# EAGLE design ESP8266_1wire_Gateway_NodeMCU_WeMosD1Mini_max (EAGLE 7.5.0)
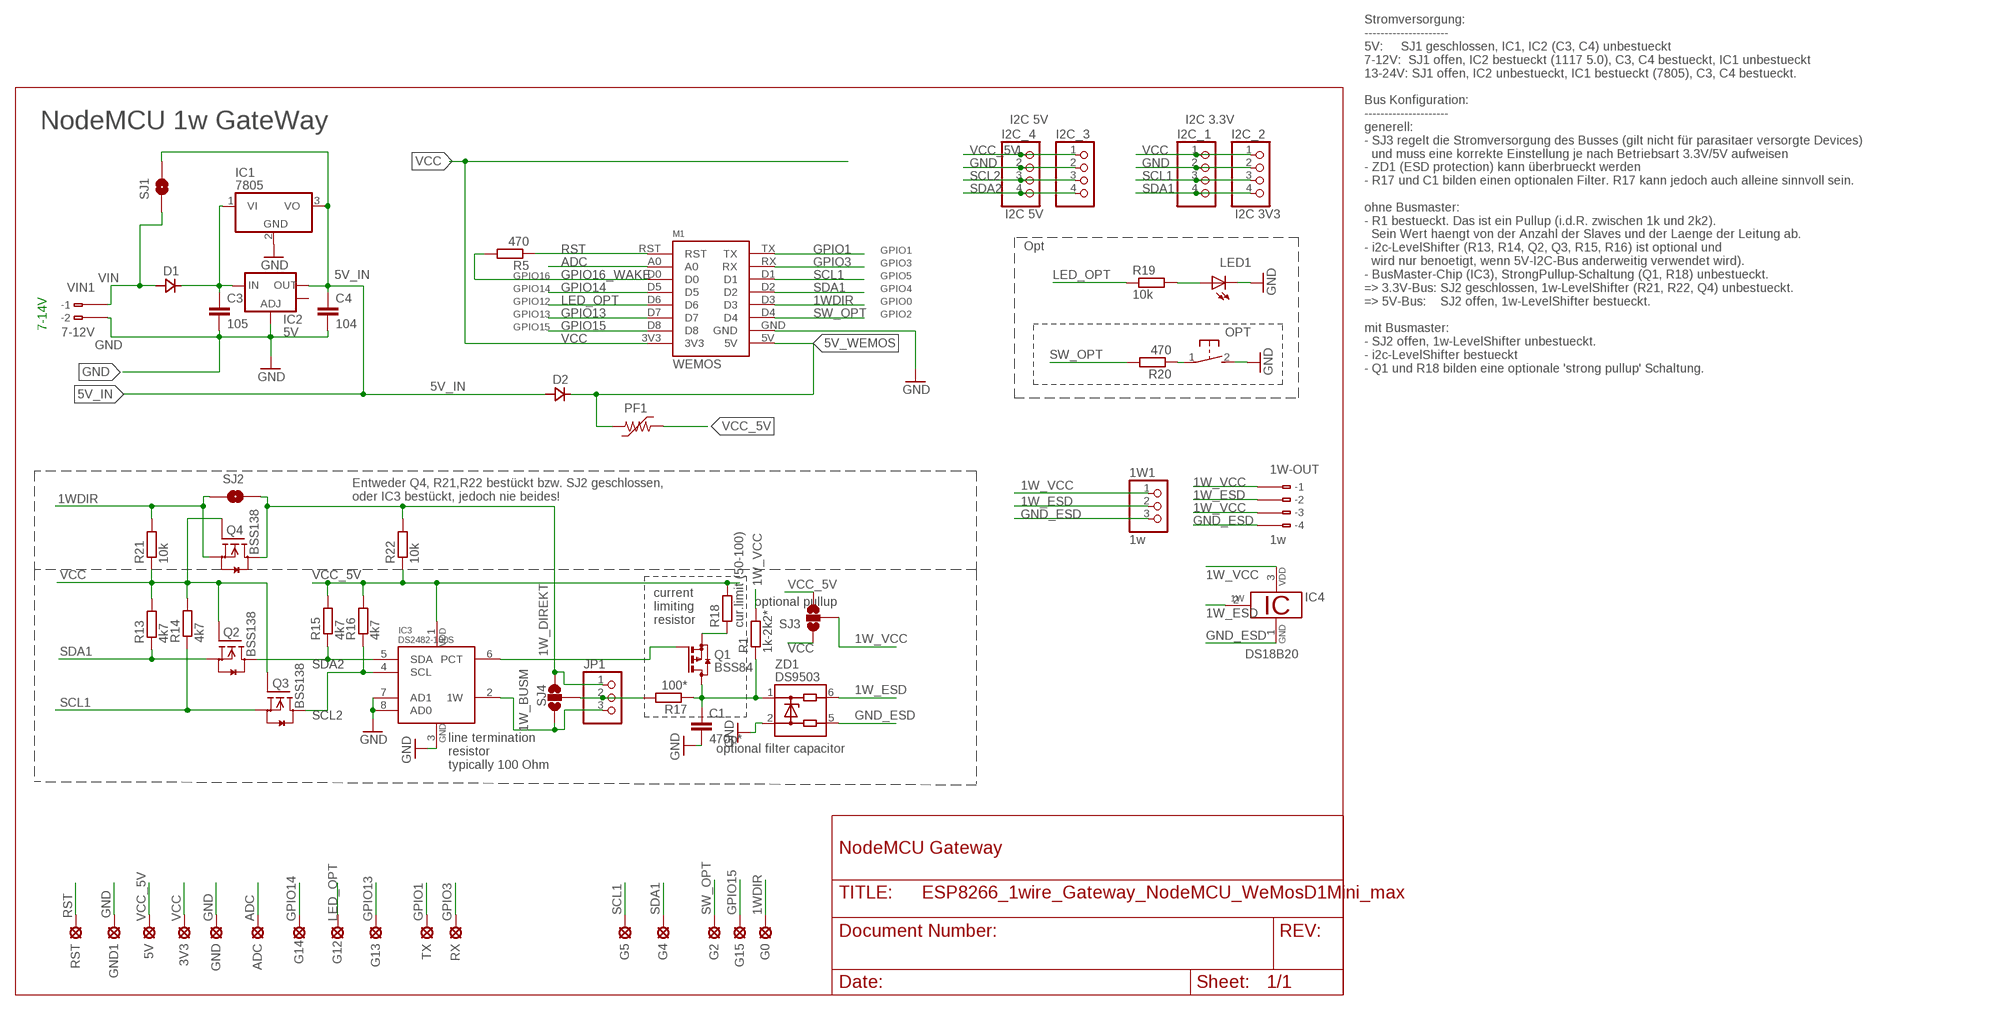
[diagram p0: schematic, sheet 1]

## Parts
1W1  1w  PINHD-1X3_S  [1X03]
1W-OUT  1w  CON_350-104  [CON_350-104]
3V3  LSP10  [LSP10]
5V  LSP10  [LSP10]
ADC  LSP10  [LSP10]
C1  470p*  C-EUC0805  [C0805]
C3  105  C-EUC0805  [C0805]
C4  104  C-EUC0805  [C0805]
D1  SS14  [DO214]
D2  SS14  [DO214]
G0  LSP10  [LSP10]
G2  LSP10  [LSP10]
G4  LSP10  [LSP10]
G5  LSP10  [LSP10]
G12  LSP10  [LSP10]
G13  LSP10  [LSP10]
G14  LSP10  [LSP10]
G15  LSP10  [LSP10]
GND  LSP10  [LSP10]
GND1  GND  LSP10  [LSP10]
I2C_1  PINHD-1X4_S  [1X04]
I2C_2  I2C 3V3  PINHD-1X4_S  [1X04]
I2C_3  PINHD-1X4_S  [1X04]
I2C_4  I2C 5V  PINHD-1X4_S  [1X04]
IC1  7805  7805TV  [TO220V]
IC2  5V  V_REG_LM1117SOT223  [SOT223]
IC3  DS2482-100S  [SO08]
IC4  DS18B20  [TO92-]
JP1  PINHD-1X3_S  [1X03]
LED1  CFG  LEDCHIPLED_1206  [CHIPLED_1206]
M1  WEMOS  [WEMOS]
OPT  OPT  DTSM-3  [DTSM-3]
PF1  500mA  PTC-F1206  [F1206]
Q1  BSS84  [SOT23]
Q2  BSS138  [SOT23]
Q3  BSS138  [SOT23]
Q4  BSS138  [SOT23]
R1  1k-2k2*  R-EU_R0805  [R0805]
R5  470  R-EU_R0805  [R0805]
R13  4k7  R-EU_R0805  [R0805]
R14  4k7  R-EU_R0805  [R0805]
R15  4k7  R-EU_R0805  [R0805]
R16  4k7  R-EU_R0805  [R0805]
R17  100*  R0805_SMALL_GAP  [R0805_SMALL_GAP]
R18  cur.limit (50-100)  R0805_SMALL_GAP  [R0805_SMALL_GAP]
R19  10k  R-EU_R0805  [R0805]
R20  470  R-EU_R0805  [R0805]
R21  10k  R-EU_R0805  [R0805]
R22  10k  R-EU_R0805  [R0805]
RST  RST  LSP10  [LSP10]
RX  LSP10  [LSP10]
SJ1  bypass vreg  JUMPER-PAD-2-NOYES_SILK  [PAD-JUMPER-2-NO_YES_SILK]
SJ2  bypass  JUMPER-PAD-2-NOYES_SILK  [PAD-JUMPER-2-NO_YES_SILK]
SJ3  5V | 3V3  JUMPER-PAD-3-NOYES_SILK  [PAD-JUMPER-3-NO_YES_SILK]
SJ4  direct | busmaster  JUMPER-PAD-3-NOYES_SILK  [PAD-JUMPER-3-NO_YES_SILK]
TX  LSP10  [LSP10]
VIN1  7-12V  CON_350-102  [CON_350-102]
ZD1  DS9503  DS9503_BYPASS_JP  [TSOC6_BYPASS_J]

## Nets
1W_: C1.1 Q1.3(D) R1.1 R17.1 ZD1.1
1W_BUSM: IC3.2(1W) JP1.3 SJ4.1
1W_DIREKT: JP1.1 Q4.3(D) R22.2 SJ2.2 SJ4.3
1W_ESD: 1W1.2 1W-OUT.B2(B-2) IC4.2(1W) ZD1.6
1W_OUT: JP1.2 R17.2 SJ4.2
1W_VCC: 1W1.1 1W-OUT.B1(B-1) 1W-OUT.B3(B-3) IC4.3(VDD) R1.2 SJ3.2
1WDIR: G0.1(MP) M1.D3 Q4.2(S) R21.2 SJ2.1
5V_IN: C4.1 D2.ANODE IC1.3(VO) IC2.2(OUT) SJ1.2
5V_WEMOS: D2.CATHODE M1.5V PF1.2
ADC: ADC.1(MP) M1.A0
GND: C1.2 C3.2 C4.2 GND1.1(MP) GND.1(MP) I2C_1.2 I2C_2.2 I2C_3.2 I2C_4.2 IC1.2(GND) IC2.1(ADJ) IC3.3(GND) IC3.7(AD1) IC3.8(AD0) LED1.C M1.GND OPT.2 VIN1.B2(B-2) ZD1.2
GND_ESD: 1W1.3 1W-OUT.B4(B-4) IC4.1(GND) ZD1.5
GPIO1: M1.TX TX.1(MP)
GPIO3: M1.RX RX.1(MP)
GPIO13: G13.1(MP) M1.D7
GPIO14: G14.1(MP) M1.D5
GPIO15: G15.1(MP) M1.D8
GPIO16_WAKE: M1.D0 R5.2
LED_OPT: G12.1(MP) M1.D6 R19.1
N$4: LED1.A R19.2
N$6: IC3.6(PCT) Q1.1(G)
N$7: Q1.2(S) R18.1
N$8: C3.1 D1.CATHODE IC1.1(VI) IC2.3(IN)
N$11: OPT.1 R20.1
RST: M1.RST R5.1 RST.1(MP)
SCL1: G5.1(MP) I2C_1.3 I2C_2.3 M1.D1 Q3.2(S) R14.1
SCL2: I2C_3.3 I2C_4.3 IC3.4(SCL) Q3.3(D) R16.1
SDA1: G4.1(MP) I2C_1.4 I2C_2.4 M1.D2 Q2.2(S) R13.1
SDA2: I2C_3.4 I2C_4.4 IC3.5(SDA) Q2.3(D) R15.1
SW_OPT: G2.1(MP) M1.D4 R20.2
VCC: 3V3.1(MP) I2C_1.1 I2C_2.1 M1.3V3 Q2.1(G) Q3.1(G) Q4.1(G) R13.2 R14.2 R21.1 SJ3.1
VCC_5V: 5V.1(MP) I2C_3.1 I2C_4.1 IC3.1(VDD) PF1.1 R15.2 R16.2 R18.2 R22.1 SJ3.3
VIN: D1.ANODE SJ1.1 VIN1.B1(B-1)
Unconnected: 1W-OUT.A1(-1) 1W-OUT.A2(-2) 1W-OUT.A3(-3) 1W-OUT.A4(-4) IC2.4(OUT) VIN1.A1(-1) VIN1.A2(-2)

## Notes on the sheet
- I2C 5V | I2C 3.3V
- NodeMCU 1w GateWay
- Opt
- GPIO1
- GPIO3
- GPIO16 | GPIO5
- GPIO14 | GPIO4
- GPIO12 | GPIO0
- GPIO13 | GPIO2
- 7-14V | GPIO15
- Stromversorgung:
  ---------------------
  5V:     SJ1 geschlossen, IC1, IC2 (C3, C4) unbestueckt
  7-12V:  SJ1 offen, IC2 bestueckt (1117 5.0), C3, C4 bestueckt, IC1 unbestueckt
  13-24V: SJ1 offen, IC2 unbestueckt, IC1 bestueckt (7805), C3, C4 bestueckt.
  
  Bus Konfiguration:
  ---------------------
  generell:
  - SJ3 regelt die Stromversorgung des Busses (gilt nicht für parasitaer versorgte Devices)
    und muss eine korrekte Einstellung je nach Betriebsart 3.3V/5V aufweisen
  - ZD1 (ESD protection) kann überbrueckt werden
  - R17 und C1 bilden einen optionalen Filter. R17 kann jedoch auch alleine sinnvoll sein.
  
  ohne Busmaster:
  - R1 bestueckt. Das ist ein Pullup (i.d.R. zwischen 1k und 2k2).  
    Sein Wert haengt von der Anzahl der Slaves und der Laenge der Leitung ab.
  - i2c-LevelShifter (R13, R14, Q2, Q3, R15, R16) ist optional und 
    wird nur benoetigt, wenn 5V-I2C-Bus anderweitig verwendet wird).
  - BusMaster-Chip (IC3), StrongPullup-Schaltung (Q1, R18) unbestueckt. 
  => 3.3V-Bus: SJ2 geschlossen, 1w-LevelShifter (R21, R22, Q4) unbestueckt. 
  => 5V-Bus:    SJ2 offen, 1w-LevelShifter bestueckt. 
  
  mit Busmaster:
  - SJ2 offen, 1w-LevelShifter unbestueckt. 
  - i2c-LevelShifter bestueckt
  - Q1 und R18 bilden eine optionale 'strong pullup' Schaltung.
- Entweder Q4, R21,R22 bestückt bzw. SJ2 geschlossen,
  oder IC3 bestückt, jedoch nie beides!
- optional pullup
- current 
  limiting 
  resistor
- optional filter capacitor
- line termination 
  resistor 
  typically 100 Ohm
- NodeMCU Gateway

## Library data of the parts
1W1 JP1 = my:PINHD-1X3_S: PIN HEADER
1W-OUT = my:CON_350-104: KF250-3.5 4p; MPN: 233-104; OC_FARNELL: unknown; OC_NEWARK: 28K9046
3V3 5V ADC G0 G2 G4 G5 G12-G15 GND GND1 RST RX TX = my:LSP10: SOLDER PAD drill 1.0 mm, distributor Buerklin, 12H555
C1 C3 C4 = resistor:C-EU: CAPACITOR, European symbol
D1 D2 = ihpcb-diode:SS14
I2C_1-I2C_4 = my:PINHD-1X4_S: PIN HEADER
IC1 = linear:78*: Positive VOLTAGE REGULATOR Source: http://cache.national.com/ds/LM/LM78L05.pdf http://www.fairchildsemi.com/ds/LM/LM7805.pdf
IC2 = SparkFun-PowerIC:V_REG_LM1117: Voltage Regulator LM1117 Standard adjustable voltage regulator but in SMD form. Spark Fun Electronics SKU : COM-00595; PROD_ID: VREG-08170
IC3 = my:DS2482-100: I2C to 1-Wire Host Adapter/Line Driver This device is a onewire host and I2C interface in one chip. It provides the complete DC/AC requirements for onewire communication, including overdrive speed mode, but, unlike the DS2480B chip, no 12V EPROM programming. Notes: For overdrive speed and 5V EEPROM programming, an external active pullup circuit must be connected to the 1W, VDD and PCT pin. See the datasheet for details. The lower two I2C adress bits of the chip can be selected by external pins, so up to 4 chips may be connected to the same I2C bus. Author: Orginal device and description from Giovanni Varasano <giovanni.varasano@fastwebnet.it> Improved by Jan Kandziora <jjj@gmx.de>
IC4 = my:DS18B20: Programmable Resolution Digital Thermometer This chip provides a onewire thermosensor with approx. 0.5°C accuracy. A programmable over/undertemperure alarm is available. The precision can be set from 9..12 bits. Notes: Vdd must be applied for accurate measurements at low temperatures, as the parasite power circuit otherwise heats the sensor. If parasite power is used, Vdd has to be connected to GND. The DS1822 is a low-cost thermometer chip, the DS18S20 is similar to the DS18B20, but with 9 Bit precision only. Author: Jan Kandziora <jjj@gmx.de>
LED1 = led:LED: LED OSRAM: - CHIPLED LG R971, LG N971, LY N971, LG Q971, LY Q971, LO R971, LY R971 LH N974, LH R974 LS Q976, LO Q976, LY Q976 LO Q996 - Hyper CHIPLED LW Q18S LB Q993, LB Q99A, LB R99A - SideLED LS A670, LO A670, LY A670, LG A670, LP A670 LB A673, LV A673, LT A673, LW A673 LH A674 LY A675 LS A676, LA A676, LO A676, LY A676, LW A676 LS A679, LY A679, LG A679 - Hyper Micro SIDELED® LS Y876, LA Y876, LO Y876, LY Y876 LT Y87S - SmartLED LW L88C, LW L88S LB L89C, LB L89S, LG L890 LS L89K, LO L89K, LY L89K LS L896, LA L896, LO L896, LY L896 - TOPLED LS T670, LO T670, LY T670, LG T670, LP T670 LSG T670, LSP T670, LSY T670, LOP T670, LYG T670 LG T671, LOG T671, LSG T671 LB T673, LV T673, LT T673, LW T673 LH T674 LS T676, LA T676, LO T676, LY T676, LB T676, LH T676, LSB T676, LW T676 LB T67C, LV T67C, LT T67C, LS T67K, LO T67K, LY T67K, LW E67C LS E67B, LA E67B, LO E67B, LY E67B, LB E67C, LV E67C, LT E67C LW T67C LS T679, LY T679, LG T679 LS T770, LO T770, LY T770, LG T770, LP T770 LB T773, LV T773, LT T773, LW T773 LH T774 LS E675, LA E675, LY E675, LS T675 LS T776, LA T776, LO T776, LY T776, LB T776 LHGB T686 LT T68C, LB T68C - Hyper Mini TOPLED® LB M676 - Mini TOPLED Santana® LG M470 LS M47K, LO M47K, LY M47K Source: http://www.osram.convergy.de LUXEON: - LUMILED® LXK2-PW12-R00, LXK2-PW12-S00, LXK2-PW14-U00, LXK2-PW14-V00 LXK2-PM12-R00, LXK2-PM12-S00, LXK2-PM14-U00 LXK2-PE12-Q00, LXK2-PE12-R00, LXK2-PE12-S00, LXK2-PE14-T00, LXK2-PE14-U00 LXK2-PB12-K00, LXK2-PB12-L00, LXK2-PB12-M00, LXK2-PB14-N00, LXK2-PB14-P00, LXK2-PB14-Q00 LXK2-PR12-L00, LXK2-PR12-M00, LXK2-PR14-Q00, LXK2-PR14-R00 LXK2-PD12-Q00, LXK2-PD12-R00, LXK2-PD12-S00 LXK2-PH12-R00, LXK2-PH12-S00 LXK2-PL12-P00, LXK2-PL12-Q00, LXK2-PL12-R00 Source: www.luxeon.com KINGBRIGHT: KA-3528ASYC Source: www.kingbright.com
M1 = 1455413453956-wemos:WEMOS
OPT = mechanics:DTSM-3: Diptronics SMD button 6x3.5 mm
PF1 = polyswitch:PTC-: POLYSWITCH Polyswitch Resetable Fuses
Q1 = transistor-small-signal:BSS84: P-CHANNEL MOS FET
Q2-Q4 = my:BSS138: Fairchild Semiconductors BSS138 N-Channel Logic Level Enhancement Mode Field Effect Transistor General Description: These N-Channel enhancement mode field effect transistors are produced using Fairchild's proprietary, high cell density, DMOS technology. These products have been designed to minimize on-state resistance while provide rugged, reliable, and fast switching performance.These products are particularly suited for low voltage, low current applications such as small servo motor control, power MOSFET gate drivers, and other switching applications. Features: 0.22 A, 50 V. RDS(ON) = 3.5Ohm @ VGS = 10 V RDS(ON) = 6.0Ohm @ VGS = 4.5 V High density cell design for extremely low RDS(ON) Rugged and Reliable Compact industry standard SOT-23 surface mount package Please send any comments to: messi@users.sourceforge.net
R1 R19 = rcl:R-EU_: RESISTOR, European symbol
R5 R13-R16 R20-R22 = resistor:R-EU_: RESISTOR, European symbol
R17 R18 = my:R0805_SMALL_GAP: SMD Resistor (0805) mit einer schmalleren Lücke (kann als Lötjumper erwendet werden)
SJ1 SJ2 = SparkFun-Passives:JUMPER-PAD-2-NO
SJ3 SJ4 = SparkFun-Passives:JUMPER-PAD-3-NO
VIN1 = my:CON_350-102: KF250-3.5 2p; MPN: 233-102; OC_FARNELL: unknown; OC_NEWARK: 28K9044
ZD1 = my:DS9503_BYPASS_J: ESD Protection Diode with Resistors This ESD protection diode is designed especially for onewire host interfaces. Unlike the DS9502, it has two additional 5Ohm resitors in the 1W and GND line. Pin 5 and 6 have to be connected to the host side, pin 1 und 2 to the network side. The 1W line is through pin 1 and 6, the GND line is through pin 2 and 5. Author: Jan Kandziora <jjj@gmx.de>

## Board
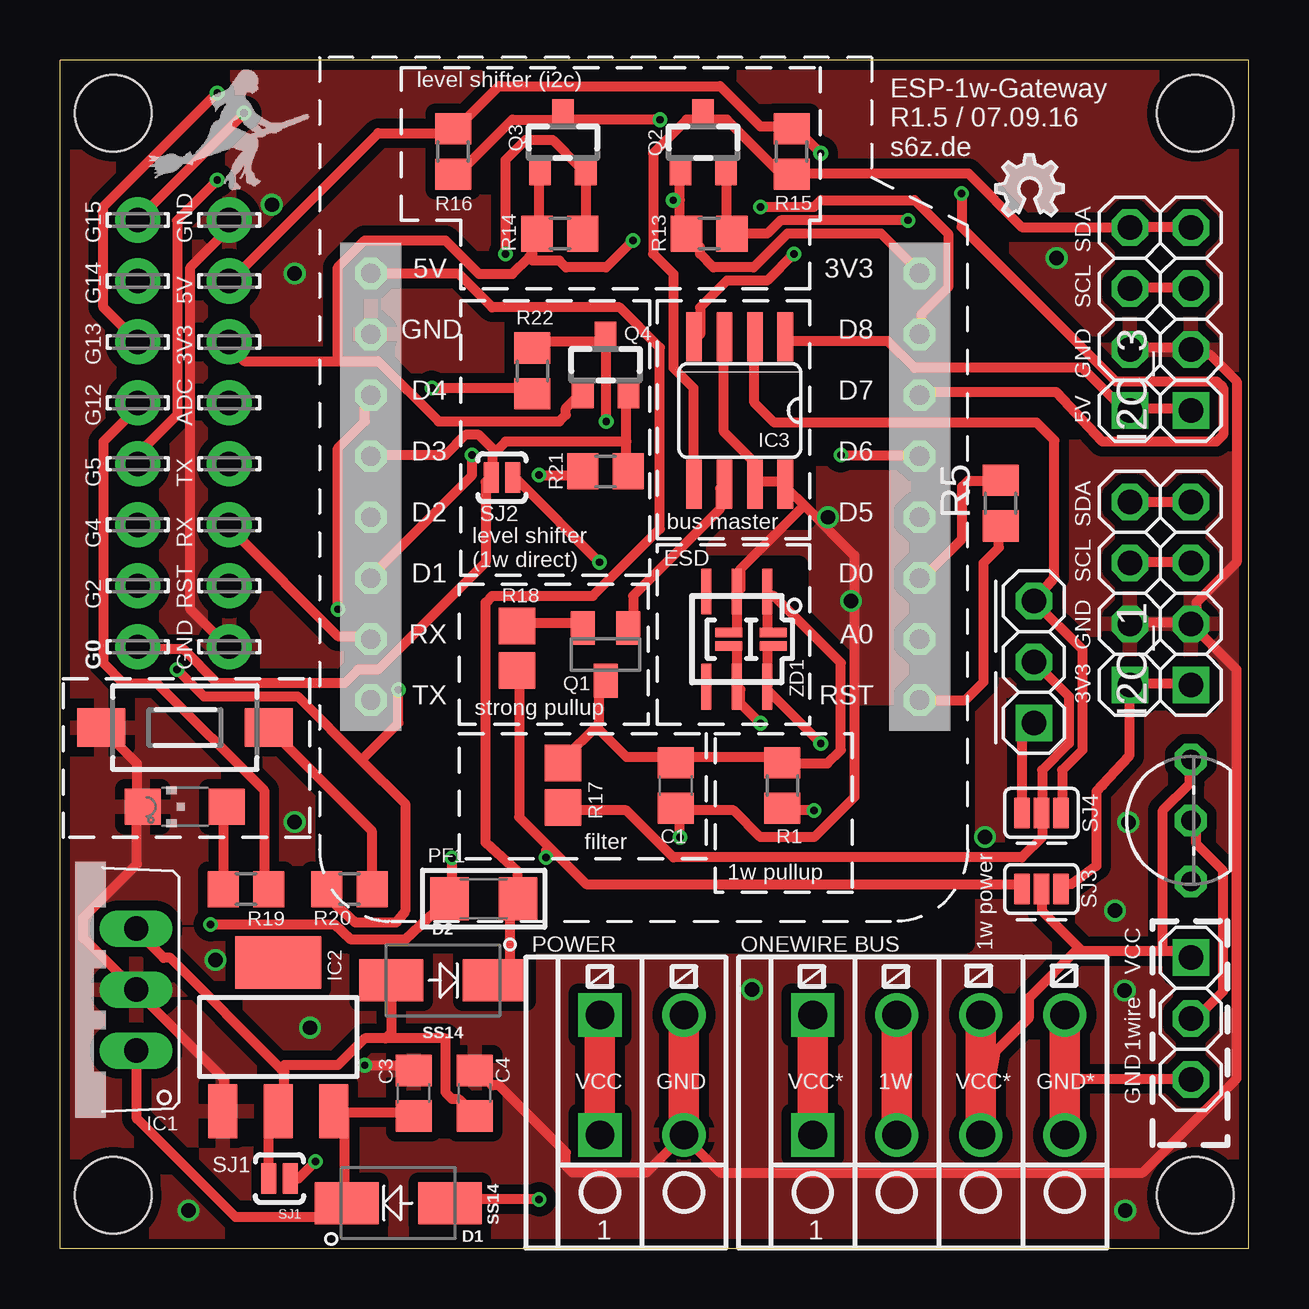
[diagram p1: board, top side]
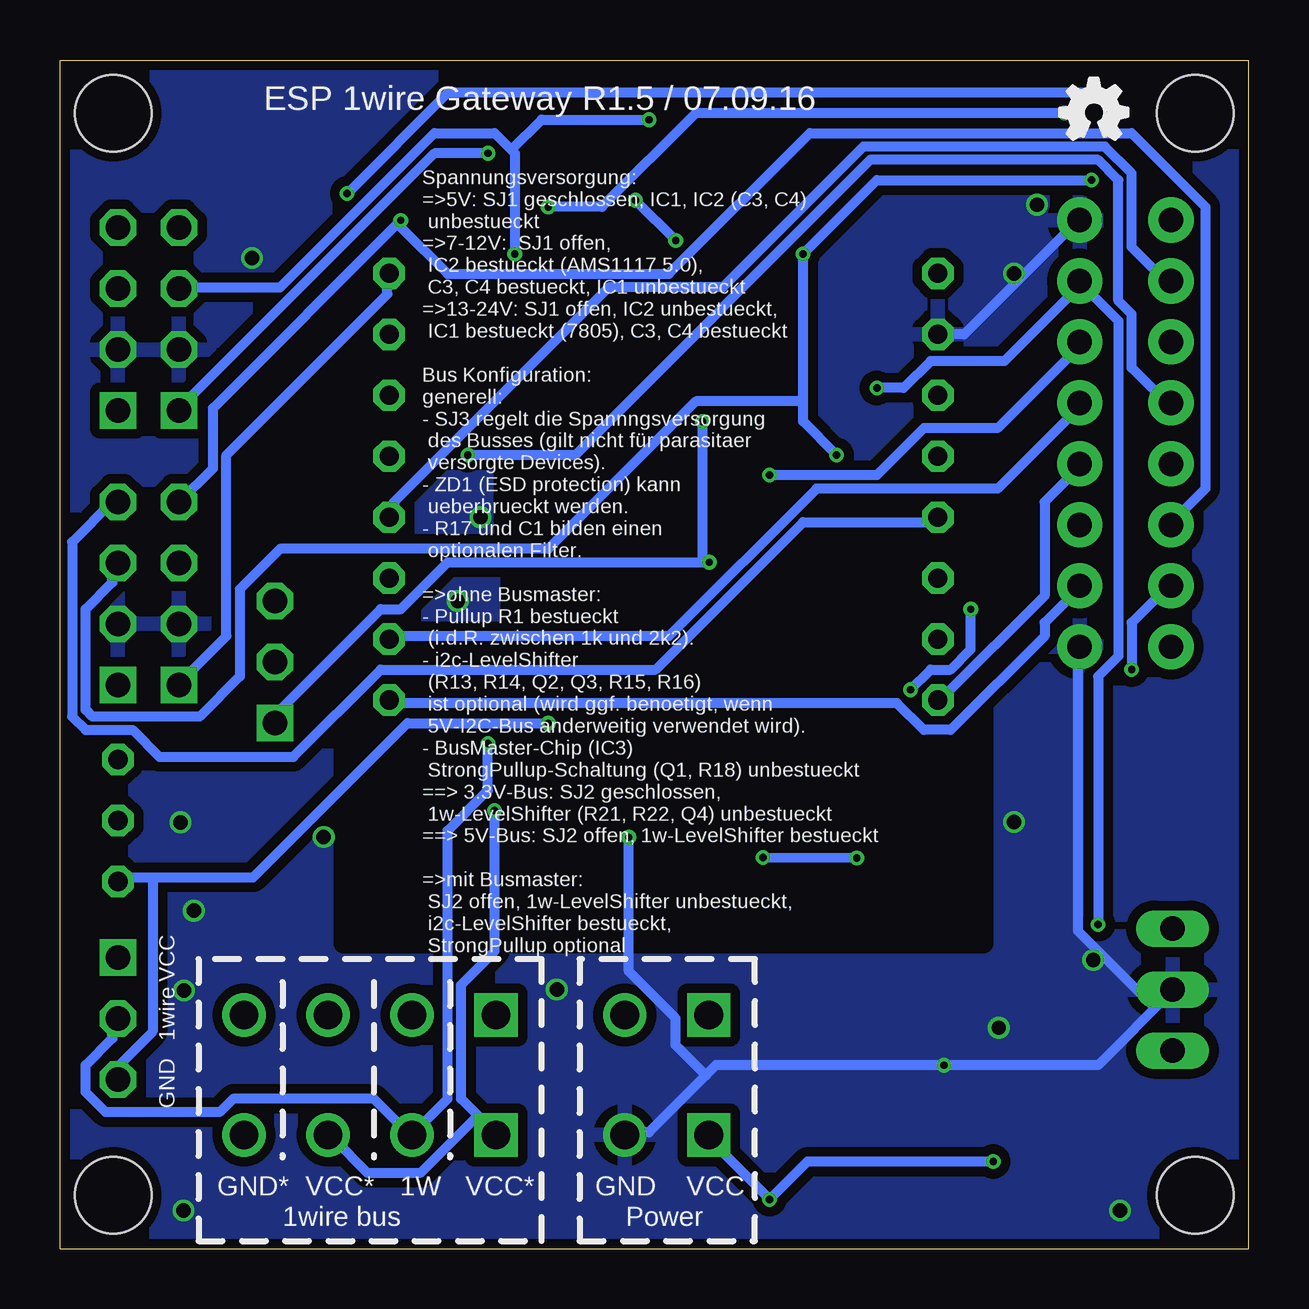
[diagram p2: board, bottom side, seen from below]

Size 49.53 x 49.53 mm. Coordinates in mm from the lower left corner, seen from the top.
Outline: 0,0 0,49.53 49.53,49.53 49.53,0 0,0
Copper layers (1*16): Top 0.035mm / dielectric 1.5mm / Bottom 0.035mm
Design rules "ITEADstudio_DRC *": minimum track width 16mil, minimum drill 12mil, track to track 6mil, track to pad 10mil, pad to pad 6mil, via to via 6mil, smd to smd 0mil, copper to edge 10mil, drill to drill 10mil, minimum pad ring 10mil, minimum via ring 6mil, stop-mask expansion 2mil, vias tented up to drill 100mil, thermal gap 16mil
Holes 3.2 mm at 2.22,2.22 47.31,2.22 2.22,47.31 47.31,47.31
tRestrict: area 11,12.7 to 37.7,22.2; area 25.6,30.4 to 31.1,39.4; area 26,22.4 to 30.8,28.5
bRestrict: area 11,12.7 to 37.7,22.2; area 26,22.4 to 30.8,28.4; area 25.6,30.4 to 31.1,39.4

### Footprints (pad centres in the part's own frame; a part is rotated, then mirrored left to right if it is on the bottom)
1X03 = drill 1.016 square: 1 -2.54,0 | drill 1.016 octagon: 2 0,0; 3 2.54,0
CON_350-104 = drill 1.2 square: A1 -3.75,2.5; B1 -3.75,-2.5 | drill 1.2: A2 -0.25,2.5; A3 3.25,2.5; A4 6.75,2.5; B2 -0.25,-2.5; B3 3.25,-2.5; B4 6.75,-2.5
LSP10 = drill 1.016 pad 1.88: 1 0,0
C0805 = smd 1.3 x 1.5: 1 -0.95,0; 2 0.95,0
DO214 = smd 2.65 x 1.75: ANODE -2.15,0; CATHODE 2.15,0
1X04 = drill 1.016 square: 1 -3.81,0 | drill 1.016 octagon: 2 -1.27,0; 3 1.27,0; 4 3.81,0
TO220V = drill 1.016 long: 1 -2.54,-2.54; 2 0,-2.54; 3 2.54,-2.54
SOT223 = smd 1.219 x 2.235: 1 -2.311,-3.099; 2 0,-3.099; 3 2.311,-3.099 | smd 3.6 x 2.2: 4 0,3.099
SO08 = smd 0.66 x 2.032: 1 -1.905,-3.073; 2 -0.635,-3.073; 3 0.635,-3.073; 4 1.905,-3.073; 5 1.905,3.073; 6 0.635,3.073; 7 -0.635,3.073; 8 -1.905,3.073
TO92- = drill 0.813 octagon: 1 -2.54,0; 2 0,0; 3 2.54,0
CHIPLED_1206 = smd 1.5 x 1.5: A 0,-1.75; C 0,1.75
WEMOS = drill 0.8 octagon: 3V3 0,0; 5V 22.86,0; A0 0,15.24; D0 0,12.7; D1 22.86,12.7; D2 22.86,10.16; D3 22.86,7.62; D4 22.86,5.08; D5 0,10.16; D6 0,7.62; D7 0,5.08; D8 0,2.54; GND 22.86,2.54; RST 0,17.78; RX 22.86,15.24; TX 22.86,17.78
DTSM-3 = smd 2 x 1.6: 1 -3.494,0; 2 3.494,0
F1206 = smd 1.6 x 1.803: 1 -1.429,0; 2 1.429,0
SOT23 = smd 1 x 1.4: 1 -0.95,-1.1; 2 0.95,-1.1; 3 0,1.1
SOT23' = smd 0.9 x 1.2: 1 -0.95,-1.2; 2 0.95,-1.2; 3 0,1.2
R0805 = smd 1.3 x 1.5: 1 -0.95,0; 2 0.95,0
R0805_SMALL_GAP = smd 1.524 x 1.524: 1 -0.927,0; 2 0.927,0
PAD-JUMPER-2-NO_YES_SILK = smd 0.635 x 1.27: 1 -0.45,0; 2 0.45,0
PAD-JUMPER-3-NO_YES_SILK = smd 0.635 x 1.27: 1 -0.813,0; 2 0,0; 3 0.813,0
CON_350-102 = drill 1.2 square: A1 -1.25,2.5; B1 -1.25,-2.5 | drill 1.2: A2 2.25,2.5; B2 2.25,-2.5
TSOC6_BYPASS_J = smd 0.406 x 1.905: 1 -1.27,-1.981; 2 0,-1.981; 3 1.27,-1.981; 4 1.27,1.981; 5 0,1.981; 6 -1.27,1.981 | smd 1.143 x 0.406: 9 -1.524,-0.274; 10 -1.524,0.286; 11 0.33,-0.274; 12 0.33,0.286

### Placement (x,y rotation side)
1W1  47.12,9.59 270 top
1W-OUT  35.12,7.24 0 top
3V3  7.05,37.78 0 top
5V  7.05,40.32 0 top
ADC  7.05,35.24 0 top
C1  25.65,19.3 270 top
C3  14.73,6.48 90 top
C4  17.27,6.48 90 top
D1  14.1,1.91 180 top
D2  15.95,11.18 0 top
G0  3.24,25.08 0 top
G2  3.24,27.62 0 top
G4  3.24,30.16 0 top
G5  3.24,32.7 0 top
G12  3.24,35.24 0 top
G13  3.24,37.78 0 top
G14  3.24,40.32 0 top
G15  3.24,42.86 0 top
GND  7.05,25.08 0 top
GND1  7.05,42.86 0 top
I2C_1  47.12,27.3 90 top
I2C_2  44.58,27.3 90 top
I2C_3  47.12,38.73 90 top
I2C_4  44.58,38.73 90 top
IC1  0.63,10.8 90 top
IC2  9.09,8.83 0 top
IC3  28.32,34.92 180 top
IC4  47.12,17.84 90 top
JP1  40.58,24.45 90 top
LED1  5.21,18.41 90 top
M1  35.81,40.64 180 top
OPT  5.21,21.72 180 top
PF1  17.65,14.58 0 top
Q1  22.73,24.77 180 top
Q2  BSS138  [SOT23']  26.8,46.1 0 top
Q3  BSS138  [SOT23']  20.95,46.1 0 top
Q4  BSS138  [SOT23']  22.73,36.83 0 top
R1  30.1,19.3 270 top
R5  39.19,31.06 90 top
R13  27.05,42.29 180 top
R14  20.83,42.29 180 top
R15  30.48,45.72 90 top
R16  16.38,45.72 90 top
R17  20.95,19.3 270 top
R18  19.05,25.02 270 top
R19  7.75,14.99 180 top
R20  12.06,14.99 180 top
R21  22.73,32.38 0 top
R22  19.69,36.58 90 top
RST  7.05,27.62 0 top
RX  7.05,30.16 0 top
SJ1  9.14,2.92 180 top
SJ2  18.41,32.13 0 top
SJ3  40.89,14.99 180 top
SJ4  40.89,18.16 180 top
TX  7.05,32.7 0 top
U$1  [OSHW_FILLX100_NOTEXT]  7.87,46.22 0 bottom
U$2  [OSHW_FILLX100_NOTEXT]  38.98,43.05 0 top
VIN1  23.75,7.24 0 top
ZD1  28.19,25.4 180 top

### Tracks (layer width: path | path; a pad name or v marks a point on that pad's centre or on a via)
1W_
  Top 0.406: 22.34,21.76 21.08,20.5 R17.1 | 22.34,21.76 22.48,21.89 22.48,23.57 Q1.3 | 22.34,21.76 23.6,20.5 25.55,20.5 C1.1 25.83,20.5 30.02,20.5 R1.1 30.3,20.22 31.98,20.22 32.54,20.78 32.54,24.41 29.74,27.2 29.46,27.2 ZD1.1
1W_BUSM
  Top 0.406: SJ4.1 41.76,18.26 41.76,19.94 42.6,20.78 42.6,24.97 JP1.3 41.43,27.96 41.43,33.69 40.69,34.42 29.76,34.42 28.93,35.25 28.93,37.82 IC3.2
1W_DIREKT  (via drill 0.3)
  Top 0.406: R22.2 19.69,37.54 19.96,37.82 22.48,37.82 Q4.3 22.76,37.82 v22.76,34.47 | v22.48,28.6 19.13,31.95 SJ2.2 | SJ4.3 40.08,21.62 40.36,21.89 JP1.1
  Bottom 0.406: 22.76,28.6 33.38,28.6 35.33,26.64 36.17,26.64 40.64,22.17 JP1.1 | 22.76,28.6 v22.76,34.47 | 22.76,28.6 v22.48,28.6
1W_ESD  (via drill 0.3)
  Top 0.406: IC4.2 47.35,17.7 47.35,16.87 48.46,15.75 48.46,10.72 47.35,9.6 1W1.2 | v31.7,21.06 29.46,23.29 ZD1.6
  Bottom 0.406: v31.7,21.06 31.7,19.1 33.38,17.42 33.38,6.25 34.77,4.85 1W-OUT.B2 35.05,4.85 36.45,6.25 42.32,6.25 42.88,5.69 47.62,5.69 48.46,6.53 48.46,7.64 47.35,8.76 47.35,9.32 1W1.2
1W_OUT
  Top 0.406: JP1.2 40.64,24.41 42.04,23.01 42.04,21.06 40.92,19.94 40.92,18.26 SJ4.2 40.92,17.98 40.92,17.14 40.08,16.31 25.55,16.31 23.6,18.26 21.08,18.26 R17.2
1W_VCC  (via drill 0.3)
  Top 0.406: v31.42,18.26 30.3,18.26 R1.2 | 42.46,12.53 42.6,12.39 45.95,12.39 | 42.46,12.53 40.92,14.07 40.92,14.91 SJ3.2 | 45.95,12.39 47.07,12.39 1W1.1 | 45.95,12.39 45.95,18.26 47.07,19.38 47.07,20.22 IC4.3 | 42.46,12.53 40.36,10.44 40.36,9.6 38.96,8.2 1W-OUT.B3
  Bottom 0.406: v31.42,18.26 31.42,12.39 32.82,11 32.82,6.25 31.42,4.85 1W-OUT.B1 32.26,5.41 34.49,3.18 36.73,3.18 38.12,4.57 1W-OUT.B3
1WDIR
  Top 0.406: 23.6,33.63 23.6,32.51 R21.2 | 23.6,33.63 23.6,35.59 Q4.2 | 18.15,33.21 18.57,33.63 23.6,33.63 | 18.15,33.21 18.01,33.07 18.01,32.23 SJ2.1 17.73,31.95 17.73,28.6 13.26,24.13 12.42,24.13 11.86,23.57 6.55,23.57 5.16,24.97 3.48,24.97 G0.1 | 18.15,33.21 17.45,33.91 16.89,33.91 16.05,33.07 12.98,33.07 M1.D3
5V_IN
  Top 0.406: 9.21,7.51 9.35,7.37 9.35,5.97 IC2.2 9.09,5.16 8.69,4.76 SJ1.2 | 9.21,7.51 4.6,12.12 4.32,12.12 3.2,13.23 IC1.3 | C4.1 17.17,5.69 16.61,6.25 16.33,6.25 16.05,6.53 16.05,8.76 13.56,8.76 | 13.56,8.76 12.7,8.76 11.58,7.64 9.35,7.64 9.21,7.51 | D2.ANODE 13.8,9 13.56,8.76
5V_WEMOS
  Top 0.406: D2.CATHODE 18.77,11.18 18.77,14.27 PF1.2 19.08,15.27 19.05,15.72 17.73,16.92 17.73,26.92 18.01,27.2 22.2,27.2 24.99,30 24.99,37.54 23.32,39.22 18.01,39.22 16.61,40.61 12.98,40.61 M1.5V
ADC
  Bottom 0.406: M1.A0 35.61,25.53 24.16,25.53 18.01,31.67 10.46,31.67 7.11,35.03 ADC.1
GND  (via drill 0.3, 0.6)
  Top 0.406: 25.83,18.26 28.07,18.26 29.19,17.14 31.42,17.14 33.1,18.82 33.1,28.88 31,30.98 | 31,30.98 30.3,31.67 IC3.8 30.02,31.95 29.19,31.95 IC3.7 28.91,31.95 28.91,32.79 27.66,34.04 27.66,37.95 IC3.3 | 31,30.98 28.35,28.32 28.35,27.48 ZD1.2 | I2C_2.2 44.83,26.09 47.07,26.09 I2C_1.2 | I2C_4.2 44.83,37.54 47.07,37.54 I2C_3.2 47.35,37.26 47.9,37.26 49.02,36.14 49.02,28.6 47.35,26.92 47.35,26.09 I2C_1.2 | C4.2 17.45,7.37 18.01,6.81 18.29,6.81 21.08,4.01 21.08,3.45 21.36,3.18 24.44,3.18 25.55,4.29 VIN1.B2 26.39,4.29 27.51,3.18 45.11,3.18 49.02,7.09 49.02,24.13 I2C_1.2 | 3.2,18.54 3.2,20.22 1.8,21.62 OPT.2 | v12.7,7.64 14.66,7.64 C3.2 | IC2.1 6.83,5.97 6.83,7.09 3.2,10.72 IC1.2 2.92,11 0.96,12.95 0.96,13.79 3.2,16.03 3.2,18.26 | GND1.1 6.83,42.85 6.83,42.29 5.44,40.89 5.44,26.64 6.83,25.25 GND.1 | v25.83,17.14 25.83,18.26 | 25.83,18.26 C1.2
  Bottom 0.406: M1.GND 11.86,38.1 7.11,42.85 GND1.1 | GND.1 7.11,24.97 7.11,13.23 4.04,10.16 IC1.2 3.2,10.72 6.27,7.64 v12.7,7.64 22.2,7.64 22.62,7.23 | 22.62,7.23 24.99,4.85 25.83,4.85 VIN1.B2 | v25.83,17.14 25.83,11.56 23.88,9.6 23.88,8.48 22.62,7.23
  other vias: 9.78,40.64 41.53,41.28 32,30.48 8.83,43.5 28.83,10.8 44.39,1.59 10.41,9.21 9.78,17.78 32.96,26.99 44.51,17.77 43.95,14.08 44.36,10.76 6.48,12.03 38.54,17.16 5.36,1.59
  pour Top (isolate 0.406): -0.38,49.53 50.42,49.53 50.42,0.32 -0.38,0.32
  pour Bottom (isolate 0.406): -0.38,49.53 50.42,49.53 50.42,0 -0.38,0
GND_ESD  (via drill 0.3)
  Top 0.406: 1W1.3 47.07,7.09 42.32,7.09 1W-OUT.B4 | v29.19,21.89 28.35,22.73 28.35,23.29 ZD1.5
  Bottom 0.406: v29.19,21.89 35.05,21.89 41.48,15.47 45.67,15.47 | 45.67,15.47 47.07,15.47 IC4.1 | 45.67,15.47 45.67,9.04 47.07,7.64 47.07,7.09 1W1.3
GPIO1
  Bottom 0.406: M1.TX 12.7,23.01 8.51,27.2 8.51,31.12 7.11,32.51 TX.1
GPIO3
  Top 0.406: M1.RX 12.7,25.53 11.58,25.53 7.11,30 RX.1
GPIO13  (via drill 0.3)
  Top 0.406: v37.57,43.97 37.57,42.57 43.99,36.14 48.18,36.14 48.46,35.87 48.46,33.91 48.18,33.63 43.43,33.63 41.5,35.69 36.02,35.69 M1.D7 | v6.55,48.16 1.8,43.41 1.8,39.22 G13.1
  Bottom 0.406: v37.57,43.97 33.38,48.16 v6.55,48.16
GPIO14
  Bottom 0.406: M1.D5 35.61,30.56 35.61,31.12 26.67,40.06 21.92,40.06 16.05,45.92 5.99,45.92 4.88,44.81 4.88,41.73 3.48,40.33 G14.1
GPIO15  (via drill 0.3)
  Top 0.406: v29.19,43.41 31.42,43.41 31.7,43.69 35.61,43.69 37.01,42.29 37.01,40.06 35.89,38.94 35.89,38.1 M1.D8 | v7.67,47.32 3.48,43.13 G15.1
  Bottom 0.406: v29.19,43.41 26.95,43.41 23.04,47.32 v7.67,47.32
GPIO16_WAKE
  Top 0.406: M1.D0 35.94,27.94 37.59,29.59 37.59,31.75 37.85,32 39.18,32 R5.2
LED_OPT  (via drill 0.3)
  Top 0.406: R19.1 8.51,15.19 8.51,19.1 4.04,23.57 2.64,23.57 1.8,24.41 1.8,33.63 3.2,35.03 G12.1 | v32.54,33.07 35.61,33.07 M1.D6
  Bottom 0.406: v32.54,33.07 28.07,33.07 15.77,45.36 6.27,45.36 5.44,44.53 5.44,39.5 4.88,38.94 4.88,36.7 3.48,35.31 G12.1
N$4
  Top 0.406: LED1.A 6.8,18.41 R19.2
N$6
  Top 0.406: Q1.1 23.88,26.09 23.88,27.2 27.51,30.84 27.51,31.67 IC3.6
N$7
  Top 0.406: Q1.2 21.64,26.09 19.13,26.09 R18.1
N$8
  Top 0.406: 11.86,5.69 14.66,5.69 C3.1 | IC1.1 3.2,8.2 3.2,5.41 3.23,5.41 7.31,1.32 10.64,1.32 11.86,1.78 D1.CATHODE 11.86,2.06 11.86,5.69 | 11.86,5.69 IC2.3
N$11
  Top 0.406: R20.1 12.98,15.19 12.98,17.42 8.79,21.62 OPT.1
RST
  Top 0.406: M1.RST 37.72,22.86 38.48,23.62 38.48,28.58 39.12,29.21 39.12,30.04 R5.1
  Bottom 0.406: M1.RST 35.61,22.73 14.66,22.73 13.54,21.62 12.42,21.62 8.51,25.53 8.51,26.09 7.11,27.48 RST.1
SCL1  (via drill 0.3)
  Top 0.406: I2C_2.3 44.83,28.6 47.07,28.6 I2C_1.3 | R14.1 21.92,42.29 21.92,44.81 Q3.2 21.64,45.08 20.52,46.2 19.41,46.2 18.57,45.36 v18.57,41.45 | v17.17,33.07 17.17,32.23 12.98,28.04 M1.D1 | v6.55,44.53 4.88,42.85 4.88,34.75 3.48,33.35 3.48,32.79 G5.1
  Bottom 0.406: 18.57,35.31 18.57,34.47 v17.17,33.07 | 18.57,35.31 v18.57,41.45 15.49,44.53 v6.55,44.53 | 18.57,35.31 23.04,35.31 29.19,29.16 40.36,29.16 42.04,27.48 42.04,23.85 43.71,22.17 48.18,22.17 48.46,22.45 48.46,26.64 47.35,27.76 47.35,28.32 I2C_1.3
SCL2  (via drill 0.3)
  Top 0.406: R16.1 16.61,44.81 18.85,47.04 20.8,47.04 Q3.3 21.08,47.04 v24.99,47.04 | v30.58,41.45 29.46,40.33 27.79,40.33 26.67,39.22 26.67,38.1 IC3.4 | I2C_3.3 47.07,40.06 44.83,40.06 I2C_4.3
  Bottom 0.406: v30.58,41.45 30.58,45.64 30.72,45.78 | 30.72,45.78 31.42,46.48 33.93,46.48 40.36,40.06 44.55,40.06 I2C_4.3 | v24.99,47.04 29.46,47.04 30.72,45.78
SDA1  (via drill 0.3)
  Top 0.406: Q2.2 27.79,44.81 27.79,42.29 R13.1 29.46,42.29 30.02,42.85 v35.33,42.85 | I2C_2.4 I2C_1.4
  Bottom 0.406: M1.D2 12.98,30.28 18.57,30.28 24.71,24.13 36.17,24.13 39.8,20.5 45.39,20.5 46.51,21.62 48.46,21.62 49.02,22.17 49.02,29.44 47.35,31.12 I2C_1.4 | I2C_2.4 44.55,31.12 43.16,32.51 43.16,35.03 v35.33,42.85 35.33,42.57 33.38,40.61 24.16,40.61 18.29,46.48 4.88,46.48 1.8,43.41 1.8,31.67 3.2,30.28 G4.1
SDA2
  Top 0.406: I2C_3.4 47.07,42.57 44.83,42.57 I2C_4.4 44.55,42.57 40.08,42.57 37.85,44.81 30.58,44.81 R15.1 30.3,44.53 27.79,47.04 26.95,47.04 Q2.3 26.67,47.04 26.11,47.04 24.71,45.64 24.71,41.45 25.55,40.61 25.55,36.7 26.39,35.87 26.39,31.95 IC3.5
SW_OPT  (via drill 0.3)
  Top 0.406: 12.56,20.36 9.91,23.01 5.99,23.01 v4.88,24.13 | 12.56,20.36 14.38,18.54 14.38,14.07 13.99,13.59 12.32,13.59 11.33,14.5 11.3,14.91 R20.2 | v11.58,26.64 11.58,33.35 12.7,34.47 12.7,35.31 M1.D4 | v14.1,23.29 14.1,21.89 12.56,20.36
  Bottom 0.406: v4.88,24.13 4.88,26.09 3.48,27.48 G2.1 | v11.58,26.64 11.58,24.97 12.42,24.13 13.26,24.13 v14.1,23.29
VCC  (via drill 0.3)
  Top 0.406: Q3.1 19.96,44.81 19.96,42.29 R14.2 19.69,42.29 19.69,41.45 19.55,41.31 | 11.58,36.98 7.67,36.98 7.11,37.54 3V3.1 | 11.58,36.98 13.26,36.98 15.77,34.47 20.8,34.47 21.08,34.75 21.08,35.03 21.64,35.59 Q4.1 | v19.96,32.23 21.64,32.23 R21.1 | 19.55,41.31 18.85,40.61 17.45,40.61 16.05,42.01 12.7,42.01 11.58,40.89 11.58,36.98 | 25.83,43.69 25.83,42.29 R13.2 26.11,42.29 26.67,41.73 26.67,41.45 27.23,40.89 28.91,40.89 30.3,42.29 34.21,42.29 35.61,40.89 M1.3V3 | 25.83,43.69 25.83,44.81 Q2.1 | SJ3.1 41.76,15.19 42.14,15.19 43.18,15.95 43.18,19.05 43.43,19.3 44.55,20.52 44.55,23.29 I2C_2.1 44.83,23.57 47.07,23.57 I2C_1.1 | v23.88,42.01 22.76,40.89 21.08,40.89 20.8,41.17 19.69,41.17 19.55,41.31 | 25.83,43.69 v25.55,43.69
  Bottom 0.406: v19.96,32.23 15.49,32.23 13.54,34.19 10.46,34.19 7.11,37.54 3V3.1 | M1.3V3 35.89,40.61 35.89,39.78 42.6,33.07 42.6,25.53 44.55,23.57 I2C_2.1 | v25.55,43.69 v23.88,42.01
VCC_5V  (via drill 0.3)
  Top 0.406: 20.38,16.73 19.13,17.98 19.13,23.85 R18.2 | 20.38,16.73 21.92,15.19 40.08,15.19 SJ3.3 | v16.33,16.28 16.33,15.32 PF1.1 14.4,12.9 12.09,12.9 11.43,13.51 v6.27,13.51 | v20.24,16.31 20.24,16.59 20.38,16.73 | IC3.1 30.3,37.82 34.49,37.82 35.61,36.7 42.6,36.7 44.55,34.75 I2C_4.1 44.83,35.03 47.07,35.03 I2C_3.1 | v15.49,35.87 19.69,35.87 R22.1 | 5V.1 7.11,40.33 13.26,46.48 16.33,46.48 R16.2 16.61,46.76 18.29,48.44 27.51,48.44 29.19,46.76 30.3,46.76 R15.2 30.58,46.76 v31.7,45.64
  Bottom 0.406: v20.24,16.31 v16.33,16.28 | v15.49,35.87 14.38,35.87 13.26,36.98 10.19,36.98 7.11,40.06 5V.1 6.83,40.06 5.44,38.66 5.44,24.69 6.27,23.85 v6.27,13.51 | v31.7,45.64 33.93,45.64 44.55,35.03 I2C_4.1
VIN  (via drill 0.3)
  Top 0.406: v19.96,2.06 16.33,2.06 D1.ANODE | SJ1.1 9.93,2.92 v10.64,3.63
  Bottom 0.406: VIN1.B1 22.48,4.57 v19.96,2.06 18.39,3.63 v10.64,3.63

### Text on the board
tPlace: level shifter (i2c) | ESP-1w-Gateway / R1.5 / 07.09.16 / s6z.de | SDA | GND | SCL | GND | 5V | SDA | SJ2 | bus master | SCL | level shifter / (1w direct) | ESD | GND | 3V3 | strong pullup | SJ4 | filter | 1w pullup | SJ3 | POWER | ONEWIRE BUS | 1w power | VCC | 1wire | VCC | GND | VCC* | 1W | VCC* | GND* | GND | SJ1
bPlace: ESP 1wire Gateway R1.5 / 07.09.16 | VCC | Spannungsversorgung: / =>5V: SJ1 geschlossen, IC1, IC2 (C3, C4) / unbestueckt / =>7-12V: SJ1 offen, / IC2 bestueckt (AMS1117 5.0), / C3, C4 bestueckt, IC1 unbestueckt / =>13-24V: SJ1 offen, IC2 unbestueckt, / IC1 bestueckt (7805), C3, C4 bestueckt / / Bus Konfiguration: / generell: / - SJ3 regelt die Spannngsversorgung / des Busses (gilt nicht für parasitaer / versorgte Devices). / - ZD1 (ESD protection) kann / ueberbrueckt werden. / - R17 und C1 bilden einen / optionalen Filter. / / =>ohne Busmaster: / - Pullup R1 bestueckt / (i.d.R. zwischen 1k und 2k2). / - i2c-LevelShifter / (R13, R14, Q2, Q3, R15, R16) / ist optional (wird ggf. benoetigt, wenn / 5V-I2C-Bus anderweitig verwendet wird). / - BusMaster-Chip (IC3) / StrongPullup-Schaltung (Q1, R18) unbestueckt / ==> 3.3V-Bus: SJ2 geschlossen, / 1w-LevelShifter (R21, R22, Q4) unbestueckt / ==> 5V-Bus: SJ2 offen, 1w-LevelShifter bestueckt / / =>mit Busmaster: / SJ2 offen, 1w-LevelShifter unbestueckt, / i2c-LevelShifter bestueckt, / StrongPullup optional | 1wire | GND | VCC | GND | VCC* | 1W | VCC* | GND* | Power | 1wire bus
tValues: wakeup | Direkt | BusMaster
bStop: s6z.de